# EAGLE schematic FullwaveCockCroftMultiplier (EAGLE 9.5.1)
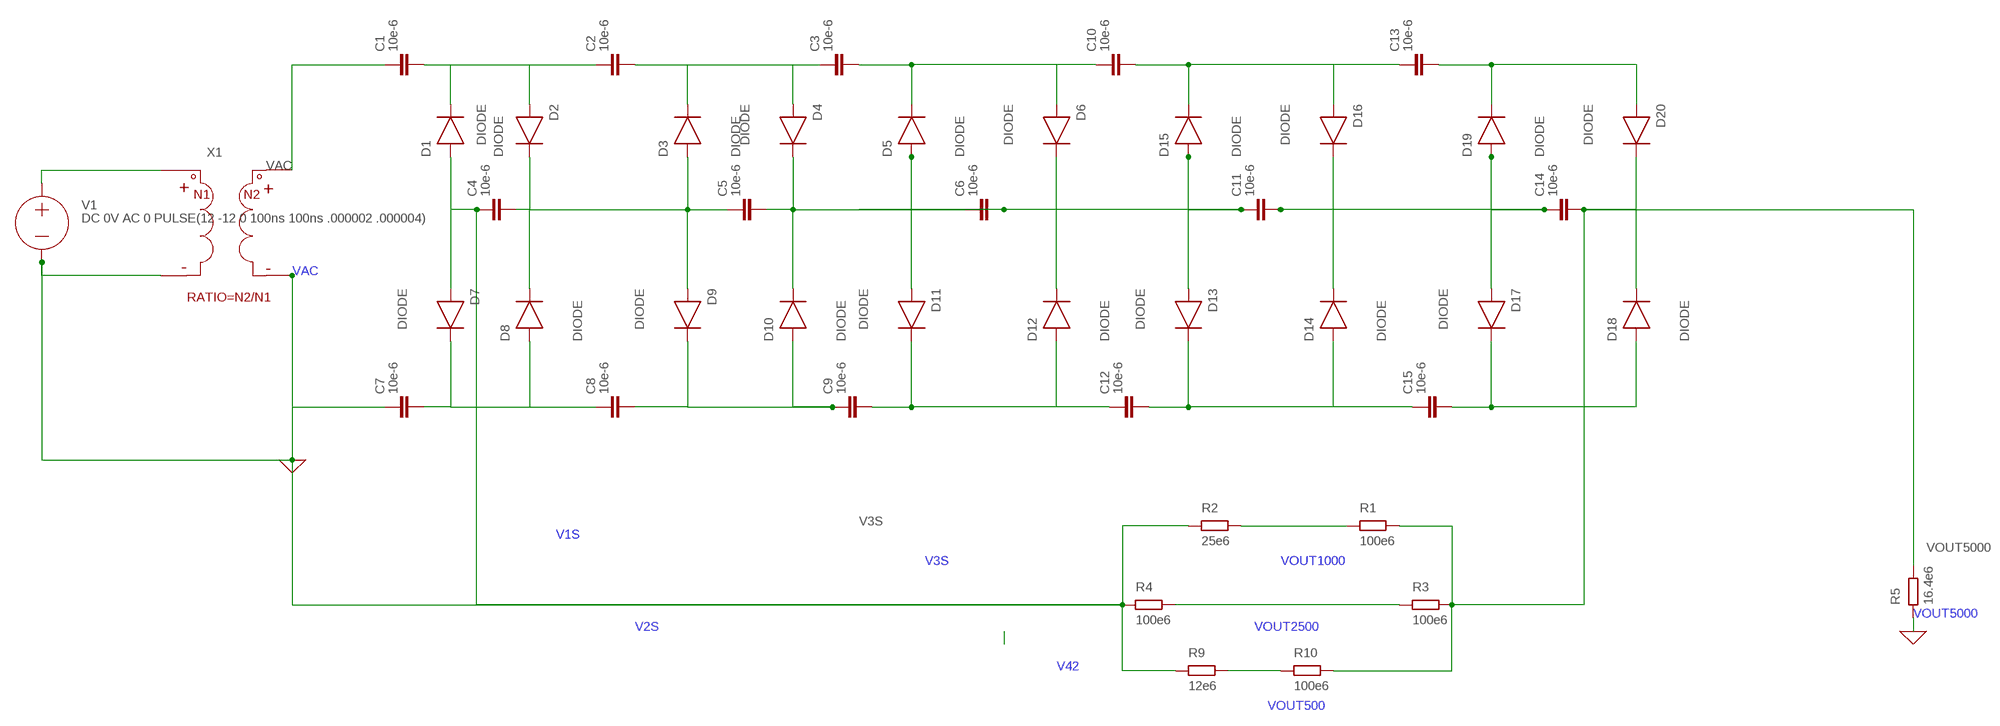
[diagram p0: schematic, sheet 1]

## Parts
C1  10e-6  C  (no package)
C2  10e-6  C  (no package)
C3  10e-6  C  (no package)
C4  10e-6  C  (no package)
C5  10e-6  C  (no package)
C6  10e-6  C  (no package)
C7  10e-6  C  (no package)
C8  10e-6  C  (no package)
C9  10e-6  C  (no package)
C10  10e-6  C  (no package)
C11  10e-6  C  (no package)
C12  10e-6  C  (no package)
C13  10e-6  C  (no package)
C14  10e-6  C  (no package)
C15  10e-6  C  (no package)
D1  DIODE  (no package)
D2  DIODE  (no package)
D3  DIODE  (no package)
D4  DIODE  (no package)
D5  DIODE  (no package)
D6  DIODE  (no package)
D7  DIODE  (no package)
D8  DIODE  (no package)
D9  DIODE  (no package)
D10  DIODE  (no package)
D11  DIODE  (no package)
D12  DIODE  (no package)
D13  DIODE  (no package)
D14  DIODE  (no package)
D15  DIODE  (no package)
D16  DIODE  (no package)
D17  DIODE  (no package)
D18  DIODE  (no package)
D19  DIODE  (no package)
D20  DIODE  (no package)
R1  100e6  R  (no package)
R2  25e6  R  (no package)
R3  100e6  R  (no package)
R4  100e6  R  (no package)
R5  16.4e6  R  (no package)
R9  12e6  R  (no package)
R10  100e6  R  (no package)
V1  DC 0V AC 0 PULSE(12 -12 0 100ns 100ns .000002 .000004)  VOLTAGE  (no package)
X1  TRANSFORMER  (no package)

## Nets
0: C4.1 C7.1 D1.A D7.A R2.1 R4.1 R5.1 R9.1 V1.- X1.P$2 X1.P$4 ; supply symbol labelled GND
N$1: C1.2 C2.1 D1.C D2.A
N$4: C2.2 C3.1 D3.C D4.A
N$6: C3.2 C10.1 D5.C D6.A
N$7: C10.2 C13.1 D15.C D16.A
N$8: C7.2 C8.1 D7.C D8.A
N$9: C8.2 C9.1 D9.C D10.A
N$10: C9.2 C12.1 D11.C D12.A
N$11: C12.2 C15.1 D13.C D14.A
N$13: C13.2 D19.C D20.A
N$14: C15.2 D17.C D18.A
N$15: V1.+ X1.P$1
V1S: C4.2 C5.1 D2.C D3.A D8.C D9.A
V2S: C5.2 C6.1 D4.C D5.A D10.C D11.A
V3S: C6.2 C11.1 D6.C D12.C D13.A D15.A
V42: C11.2 C14.1 D14.C D16.C D17.A D19.A
VAC: C1.1 X1.P$3
VOUT500: R9.2 R10.1
VOUT1000: R1.1 R2.2
VOUT2500: R3.1 R4.2
VOUT5000: C14.2 D18.C D20.C R1.2 R3.2 R5.2 R10.2

## Library data of the parts
C1-C15 = ngspice-simulation:C: CAPACITOR; SPICEPREFIX: C
D1-D20 = ngspice-simulation:DIODE: Diode; SPICEPREFIX: D
R1-R4 R9 R10 = ngspice-simulation:R: RESISTOR
R5 = ngspice-simulation:R: RESISTOR; SPICEPREFIX: R
V1 = ngspice-simulation:VOLTAGE: Independent Voltage Source, either DC, AC, PULSE, SINE, PWL, EXP, or SFFM; SPICEPREFIX: V; VALUE: 0V
X1 = ngspice-simulation:TRANSFORMER: Coupled inductors The RATIO is defined in the schematic by using the text command and adding a line that says: .PARAM RATIO=x Where x is the turns ratio of the transformer